# Altium schematic sheet MP1484.SchDoc
size 292 x 193 mm; Author: Power Lin; SheetNumber: 1; SheetTotal: 1; Website: wiki-power.com
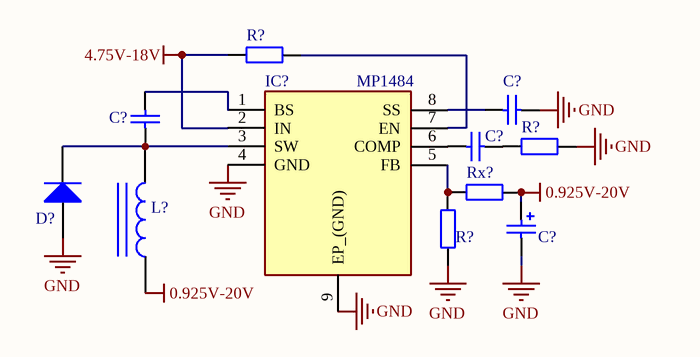
[diagram p0: MP1484.SchDoc]

## Parts
(Parts that share a designator on the sheet are numbered #1, #2 ... from top to bottom, then left to right.)
C?#1  100nF  [CAP-0603]  (value not drawn)
C?#2  6.8nF  [CAP-0603]  (value not drawn)
C?#3  100nF  [CASE-B_3528]  (value not drawn)
C?#4  10nF  [CAP-0603]  (value not drawn)
D?  SS14  [SOD_123]  (value not drawn)
IC?  MP1484  [SOIC_8_PAD]
L?  10uH 5A  [XAL6060-103MEB]  (value not drawn)
R?#1  100K  [R-0603]  (value not drawn)
R?#2  6.8K  [R-0603]  (value not drawn)
R?#3  10K  [R-0603]  (value not drawn)
Rx?  44.2K  [R-0603]  (value not drawn)

## Nets
4.75V-18V: IC?.2(IN) R?#1.1
 0.925V-20V: C?#3.1 L?.1 Rx?.2
GND: C?#1.1 C?#3.2 D?.1(A) IC?.4(GND) IC?.9(EP_(GND)) R?#2.2 R?#3.1
NetC?#1_2: C?#1.2 IC?.8(SS)
NetC?#2_1: C?#2.1 R?#2.1
NetC?#2_2: C?#2.2 IC?.6(COMP)
NetC?#4_1: C?#4.1 D?.2(K) IC?.3(SW) L?.2
NetC?#4_2: C?#4.2 IC?.1(BS)
NetIC?_5: IC?.5(FB) R?#3.2 Rx?.1
NetIC?_7: IC?.7(EN) R?#1.2

## Notes on the sheet
- Author
- DocumentName
- ModifiedDate
- ProjectName
- SheetNumber
- SheetTotal
- Website
- Revision

## Library data of the parts
C?#1 C?#2 C?#4 = CAP: 贴片电容; ComponentLink1Description: 供应商链接; ComponentLink1URL: http://www.szlcsc.com/product/details_53938.html; Package: 0402; Supplier: LC; SuppliersPartNumber: C52923
C?#3 = CAP-POL: 贴片电容-有极性; ComponentLink1Description: 供应商链接; ComponentLink1URL: http://www.szlcsc.com/product/details_16815.html; Package: 3528; Supplier: LC; SuppliersPartNumber: C16133
D? = DIODE: 二极管; ComponentLink1Description: 供应商链接; ComponentLink1URL: http://www.szlcsc.com/product/details_23178.html; Package: SMA(DO-214AC); Supplier: LC; SuppliersPartNumber: C22452
IC? = MP1484: 同步降压稳压器; Manufacturer_Name: Monolithic Power Systems (MPS); Manufacturer_Part_Number: MP1484EN-LF; Datasheet Link: http://www.mouser.com/datasheet/2/277/MP1484-1186021.pdf; Height: 1.7mm; Mouser Part Number: 946-MP1484ENLF; Mouser Price/Stock: https://www.mouser.com/Search/Refine.aspx?Keyword=946-MP1484ENLF
L? = INDUCTOR: 贴片电感; ComponentLink1Description: 供应商链接; ComponentLink1URL: http://www.szlcsc.com/product/details_33003.html; Package: 0402; Supplier: LC; SuppliersPartNumber: C32041
R?#1-R?#3 Rx? = RES: 贴片电阻; Package: 0805; Supplier: LC; SuppliersPartNumber: C17798